# EAGLE design CPLD44 (EAGLE 6.6.0)
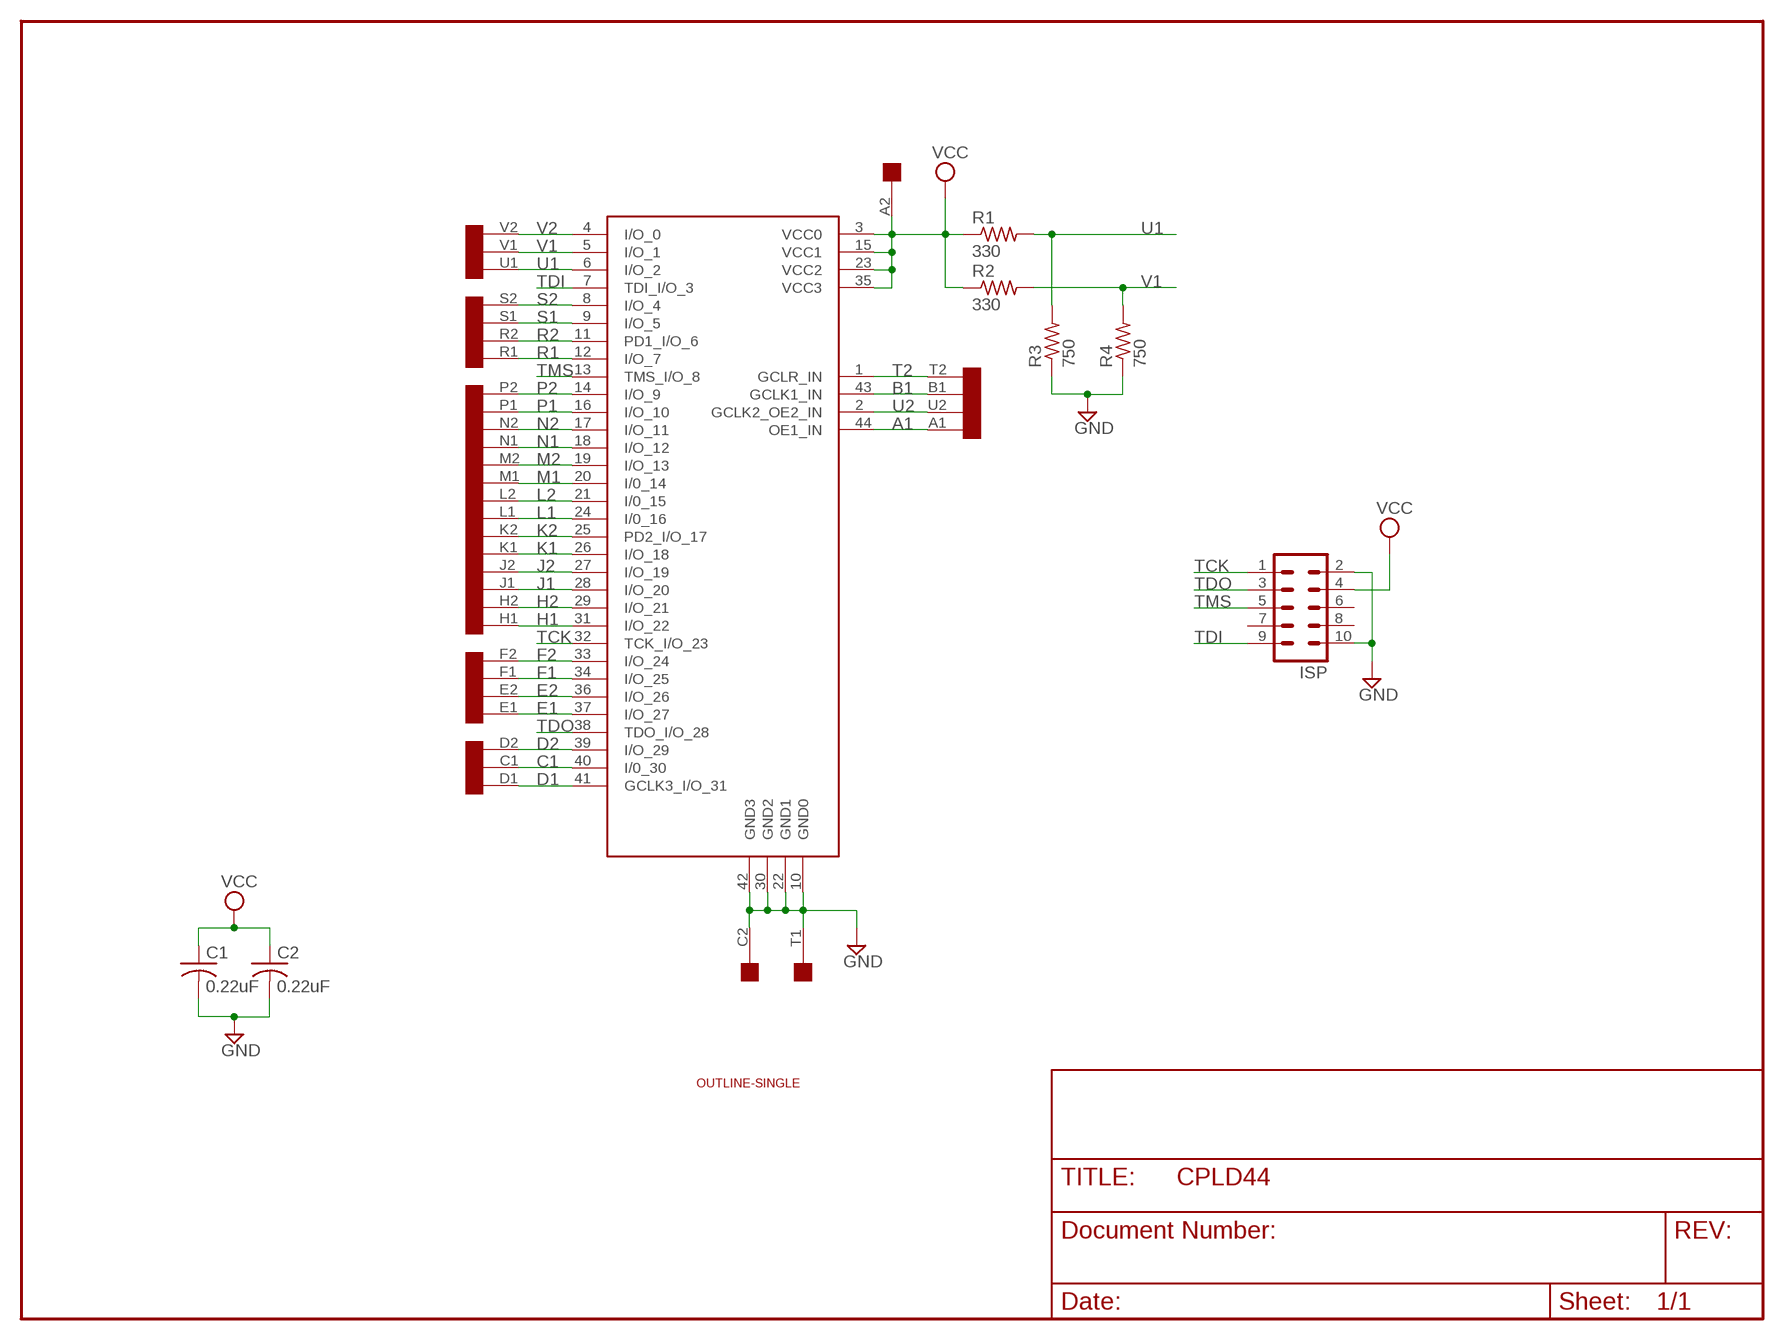
[diagram p0: schematic, sheet 1]

## Parts
C1  0.22uF  C-US050-025X075  [C050-025X075]
C2  0.22uF  C-US050-025X075  [C050-025X075]
E1  ATF1502PLCC44  [3M44]
ISP  MA05-2  [MA05-2]
R1  330  R-US_0207/10  [0207/10]
R2  330  R-US_0207/10  [0207/10]
R3  750  R-US_0207/10  [0207/10]
R4  750  R-US_0207/10  [0207/10]
U$1  SINGLE  [EDGE-CON2]
U$3  OUTLINE-SINGLE  [SINGLE]

## Nets
A1: E1.44(OE1_IN) U$1.A1
B1: E1.43(GCLK1_IN) U$1.B1
C1: E1.40(I/0_30) U$1.C1
D1: E1.41(GCLK3_I/O_31) U$1.D1
D2: E1.39(I/O_29) U$1.D2
E1: E1.37(I/O_27) U$1.E1
E2: E1.36(I/O_26) U$1.E2
F1: E1.34(I/O_25) U$1.F1
F2: E1.33(I/O_24) U$1.F2
GND: C1.2 C2.2 E1.10(GND0) E1.22(GND1) E1.30(GND2) E1.42(GND3) ISP.2 ISP.10 R3.1 R4.1 U$1.C2 U$1.T1
H1: E1.31(I/O_22) U$1.H1
H2: E1.29(I/O_21) U$1.H2
J1: E1.28(I/O_20) U$1.J1
J2: E1.27(I/O_19) U$1.J2
K1: E1.26(I/O_18) U$1.K1
K2: E1.25(PD2_I/O_17) U$1.K2
L1: E1.24(I/0_16) U$1.L1
L2: E1.21(I/0_15) U$1.L2
M1: E1.20(I/0_14) U$1.M1
M2: E1.19(I/O_13) U$1.M2
N1: E1.18(I/O_12) U$1.N1
N2: E1.17(I/O_11) U$1.N2
P1: E1.16(I/O_10) U$1.P1
P2: E1.14(I/O_9) U$1.P2
R1: E1.12(I/O_7) U$1.R1
R2: E1.11(PD1_I/O_6) U$1.R2
S1: E1.9(I/O_5) U$1.S1
S2: E1.8(I/O_4) U$1.S2
T2: E1.1(GCLR_IN) U$1.T2
TCK: E1.32(TCK_I/O_23) ISP.1
TDI: E1.7(TDI_I/O_3) ISP.9
TDO: E1.38(TDO_I/O_28) ISP.3
TMS: E1.13(TMS_I/O_8) ISP.5
U1: E1.6(I/O_2) R1.2 R3.2 U$1.U1
U2: E1.2(GCLK2_OE2_IN) U$1.U2
V1: E1.5(I/O_1) R2.2 R4.2 U$1.V1
V2: E1.4(I/O_0) U$1.V2
VCC: C1.1 C2.1 E1.3(VCC0) E1.15(VCC1) E1.23(VCC2) E1.35(VCC3) ISP.4 R1.1 R2.1 U$1.A2
Unconnected: ISP.6 ISP.7 ISP.8 U$1.B2

## Library data of the parts
C1 C2 = rcl:C-US: CAPACITOR, American symbol
E1 = atmel-cpld:ATF1502: ATD1502 CPLD
ISP = con-lstb:MA05-2: PIN HEADER
R1-R4 = rcl:R-US_: RESISTOR, American symbol
U$1 = dec-con:SINGLE: Single-Height DEC board
U$3 = dec-con:OUTLINE-*: Board outlines for DEC boards.

## Board
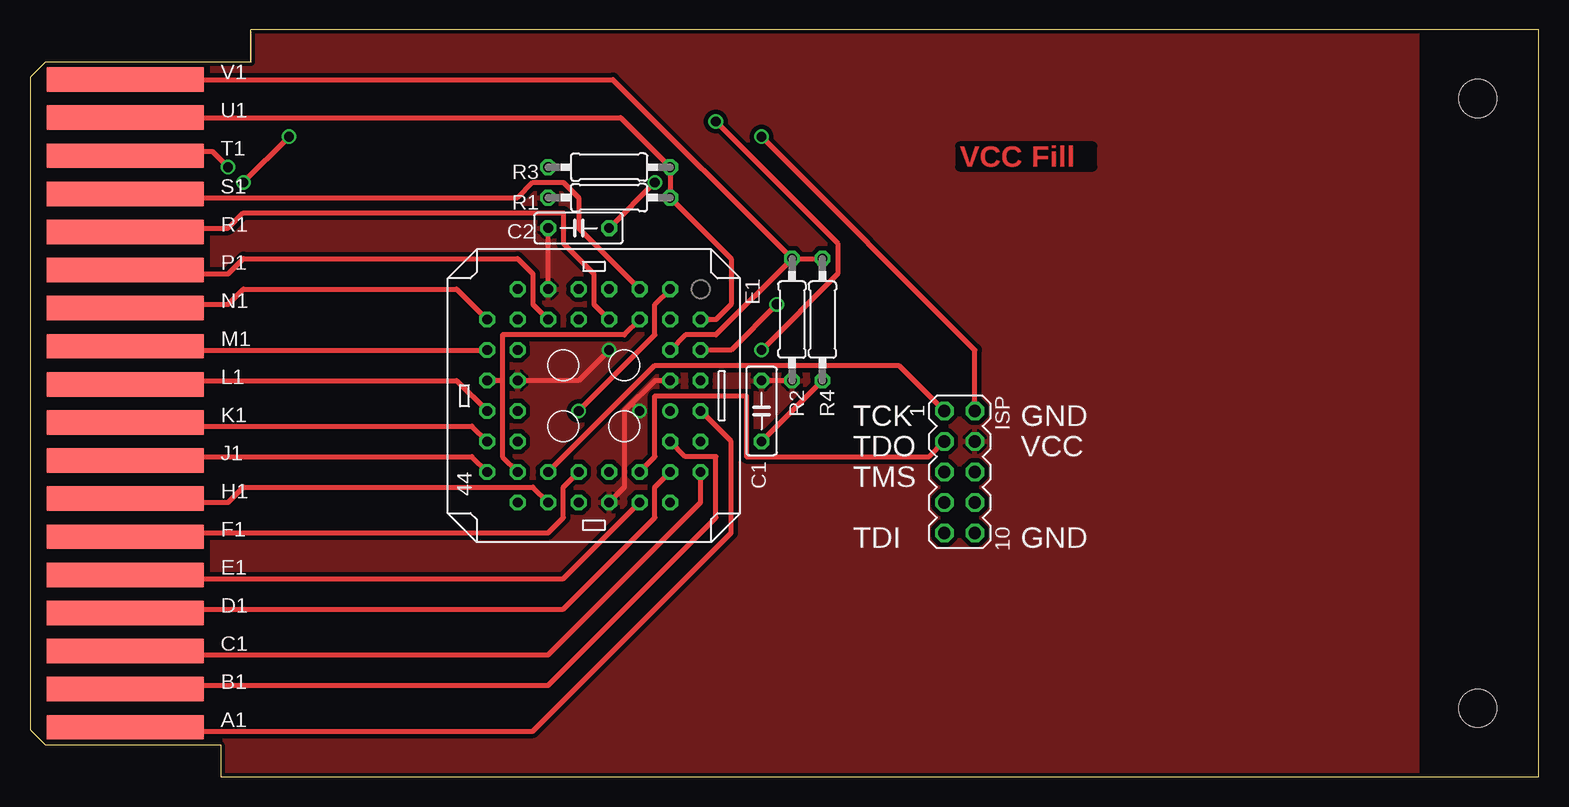
[diagram p1: board, top side]
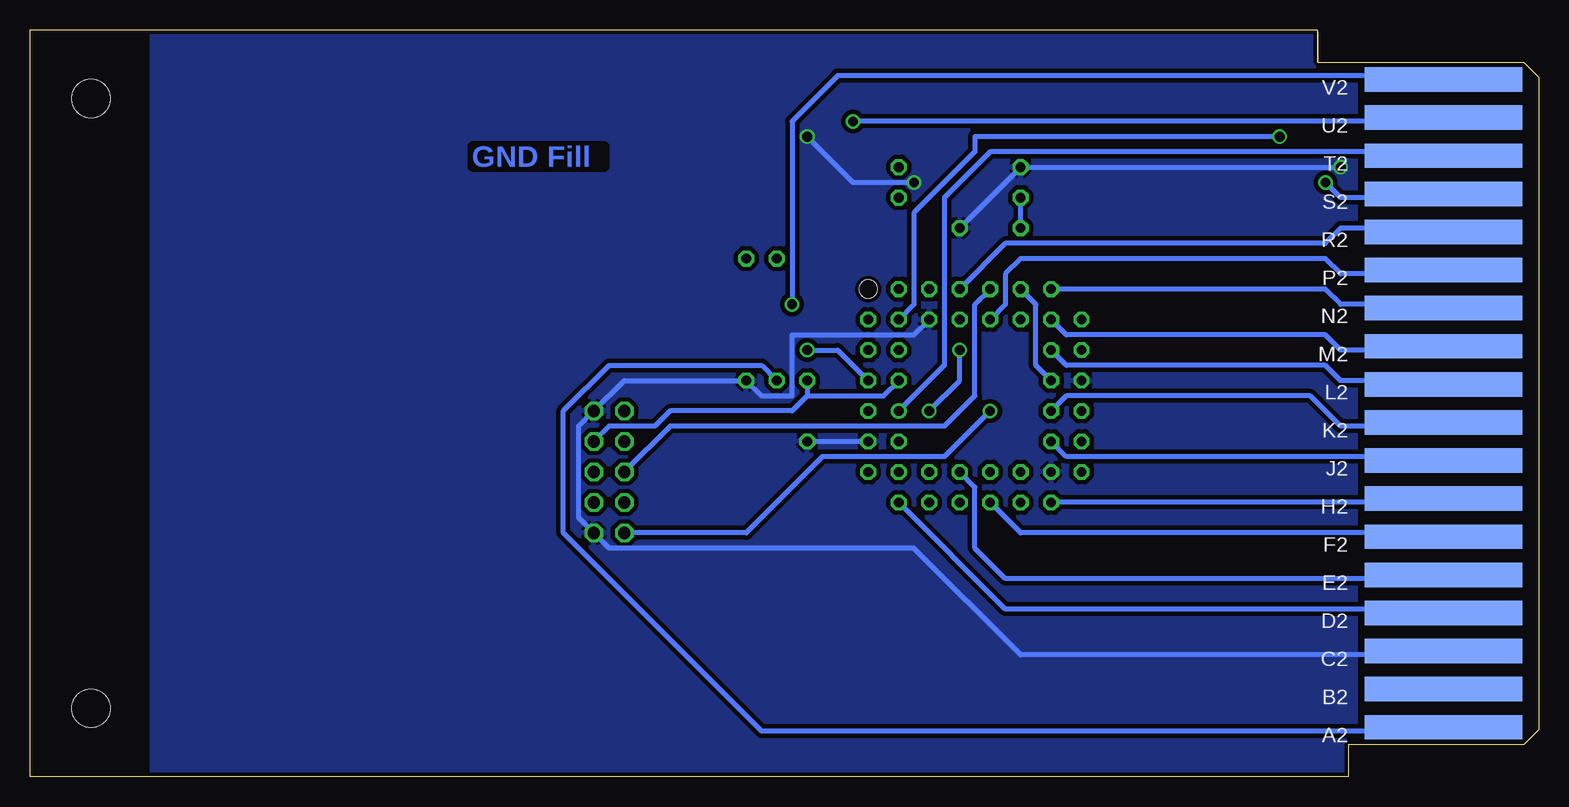
[diagram p2: board, bottom side, seen from below]

Size 125.73 x 62.23 mm. Coordinates in mm from the lower left corner, seen from the top.
Copper layers (1+16): Top 0.035mm / dielectric 1.5mm / Bottom 0.035mm
Design rules "16mils": minimum track width 16mil, minimum drill 32mil, track to track 15mil, track to pad 10mil, pad to pad 10mil, via to via 10mil, smd to smd 10mil, copper to edge 13mil, drill to drill 10mil, minimum pad ring 10mil, minimum via ring 8mil, stop-mask expansion 0mil, vias tented up to drill 0mil, thermal gap 10mil

### Footprints (pad centres in the part's own frame; a part is rotated, then mirrored left to right if it is on the bottom)
C050-025X075 = drill 0.813 octagon: 1 -2.54,0; 2 2.54,0
3M44 = drill 0.813: 1 1.27,6.35 | drill 0.813 octagon: 2 -1.27,8.89; 3 -1.27,6.35; 4 -3.81,8.89; 5 -3.81,6.35; 6 -6.35,8.89; 7 -8.89,6.35; 8 -6.35,6.35; 9 -8.89,3.81; 10 -6.35,3.81; 11 -8.89,1.27; 12 -6.35,1.27; 13 -8.89,-1.27; 14 -6.35,-1.27; 15 -8.89,-3.81; 16 -6.35,-3.81; 17 -8.89,-6.35; 18 -6.35,-8.89; 19 -6.35,-6.35; 20 -3.81,-8.89; 21 -3.81,-6.35; 22 -1.27,-8.89; 23 -1.27,-6.35; 24 1.27,-8.89; 25 1.27,-6.35; 26 3.81,-8.89; 27 3.81,-6.35; 28 6.35,-8.89; 29 8.89,-6.35; 30 6.35,-6.35; 31 8.89,-3.81; 32 6.35,-3.81; 33 8.89,-1.27; 34 6.35,-1.27; 35 8.89,1.27; 36 6.35,1.27; 37 8.89,3.81; 38 6.35,3.81; 39 8.89,6.35; 40 6.35,8.89; 41 6.35,6.35; 42 3.81,8.89; 43 3.81,6.35; 44 1.27,8.89 | hole 1.499: -8.89,8.89
MA05-2 = drill 1.016 octagon: 1 -5.08,-1.27; 2 -5.08,1.27; 3 -2.54,-1.27; 4 -2.54,1.27; 5 0,-1.27; 6 0,1.27; 7 2.54,-1.27; 8 2.54,1.27; 9 5.08,-1.27; 10 5.08,1.27
0207/10 = drill 0.813 octagon: 1 -5.08,0; 2 5.08,0
EDGE-CON2 = smd 13.106 x 2.032: A1 7.938,4.128; B1 7.938,7.303; C1 7.938,10.477; D1 7.938,13.652; E1 7.938,16.828; F1 7.938,20.003; H1 7.938,23.177; J1 7.938,26.352; K1 7.938,29.527; L1 7.938,32.703; M1 7.938,35.877; N1 7.938,39.053; P1 7.938,42.227; R1 7.938,45.403; S1 7.938,48.578; T1 7.938,51.752; U1 7.938,54.928; V1 7.938,58.102 | smd 13.106 x 2.032 bottom: A2 7.938,4.128; B2 7.938,7.303; C2 7.938,10.477; D2 7.938,13.652; E2 7.938,16.828; F2 7.938,20.003; H2 7.938,23.177; J2 7.938,26.352; K2 7.938,29.527; L2 7.938,32.703; M2 7.938,35.877; N2 7.938,39.053; P2 7.938,42.227; R2 7.938,45.403; S2 7.938,48.578; T2 7.938,51.752; U2 7.938,54.928; V2 7.938,58.102
SINGLE = hole 3.175: 120.65,56.515; 120.65,5.715

### Placement (x,y rotation side)
C1  60.96,30.48 270 top
C2  45.72,45.72 0 top
E1  46.99,31.75 270 top
ISP  77.47,25.4 270 top
R1  48.26,48.26 0 top
R2  63.5,38.1 90 top
R3  48.26,50.8 0 top
R4  66.04,38.1 90 top
U$1  0,0 0 top
U$3  0,0 0 top

### Tracks (layer width: path | path; a pad name or v marks a point on that pad's centre or on a via)
A1
  Top 0.406: U$1.A1 8.57,4.13 8.89,3.81 41.91,3.81 58.42,20.32 58.42,27.94 E1.44
B1
  Top 0.406: U$1.B1 8.57,7.3 8.89,7.62 43.18,7.62 57.15,21.59 57.15,26.67 54.61,26.67 E1.43
C1
  Top 0.406: U$1.C1 8.57,10.48 8.89,10.16 43.18,10.16 55.88,22.86 E1.40
D1
  Top 0.406: U$1.D1 8.57,13.65 8.89,13.97 44.45,13.97 52.07,21.59 52.07,24.13 E1.41
D2
  Bottom 0.406: U$1.D2 8.57,13.65 8.89,13.97 44.45,13.97 E1.39
E1
  Top 0.406: U$1.E1 8.57,16.83 8.89,16.51 44.45,16.51 E1.37
E2
  Bottom 0.406: U$1.E2 8.57,16.83 8.89,16.51 44.45,16.51 46.99,19.05 46.99,24.13 E1.36
F1
  Top 0.406: U$1.F1 8.57,20 8.89,20.32 43.18,20.32 44.45,21.59 44.45,24.13 E1.34
F2
  Bottom 0.406: U$1.F2 8.57,20 8.89,20.32 43.18,20.32 E1.33
GND  (via drill 0.81)
  Top 0.406: E1.30 39.37,26.67 39.37,33.02 | 39.37,33.02 E1.22 | E1.10 49.53,36.83 39.37,36.83 39.37,33.02 | v16.51,50.8 15.24,52.07 10.16,52.07 9.84,51.75 U$1.T1 | R4.1 C1.2 | ISP.2 78.74,35.56 v60.96,53.34 | v52.07,49.53 C2.2
  Bottom 0.406: C2.2 R3.1 v16.51,50.8 | C1.2 E1.42 | U$1.C2 13.97,10.16 43.18,10.16 52.07,19.05 77.47,19.05 ISP.10 80.01,21.59 80.01,29.21 ISP.2 76.2,33.02 R4.1 64.77,31.75 62.23,31.75 62.23,36.83 52.07,36.83 E1.10 | v60.96,53.34 57.15,49.53 v52.07,49.53
  pour Bottom: 15.24,0 15.24,60.96 15.24,62.23 115.57,62.23 115.57,0
H1
  Top 0.406: U$1.H1 8.57,23.18 8.89,22.86 16.51,22.86 17.78,24.13 41.91,24.13 E1.31
H2
  Bottom 0.406: U$1.H2 8.57,23.18 8.89,22.86 E1.29
J1
  Top 0.406: U$1.J1 8.57,26.35 8.89,26.67 36.83,26.67 E1.28
J2
  Bottom 0.406: U$1.J2 8.57,26.35 8.89,26.67 39.37,26.67 E1.27
K1
  Top 0.406: U$1.K1 8.57,29.53 8.89,29.21 36.83,29.21 E1.26
K2
  Bottom 0.406: U$1.K2 8.57,29.53 8.89,29.21 16.51,29.21 19.05,31.75 39.37,31.75 E1.25
L1
  Top 0.406: U$1.L1 8.57,32.7 8.89,33.02 35.56,33.02 E1.24
L2
  Bottom 0.406: U$1.L2 8.57,32.7 8.89,33.02 16.51,33.02 17.78,34.29 39.37,34.29 E1.21
M1
  Top 0.406: U$1.M1 8.57,35.88 8.89,35.56 E1.20
M2
  Bottom 0.406: U$1.M2 8.57,35.88 8.89,35.56 16.51,35.56 17.78,36.83 39.37,36.83 E1.19
N1
  Top 0.406: U$1.N1 8.57,39.05 8.89,39.37 16.51,39.37 17.78,40.64 35.56,40.64 E1.18
N2
  Bottom 0.406: U$1.N2 8.57,39.05 8.89,39.37 16.51,39.37 17.78,40.64 E1.17
P1
  Top 0.406: U$1.P1 8.57,42.23 8.89,41.91 16.51,41.91 17.78,43.18 40.64,43.18 41.91,41.91 41.91,39.37 E1.16
P2
  Bottom 0.406: U$1.P2 8.57,42.23 8.89,41.91 16.51,41.91 17.78,43.18 43.18,43.18 44.45,41.91 44.45,39.37 E1.14
R1
  Top 0.406: U$1.R1 8.57,45.4 8.89,45.72 16.51,45.72 17.78,46.99 44.45,46.99 44.45,44.45 46.99,41.91 46.99,39.37 E1.12
R2
  Bottom 0.406: U$1.R2 8.57,45.4 8.89,45.72 16.51,45.72 17.78,44.45 44.45,44.45 E1.11
S1
  Top 0.406: U$1.S1 8.57,48.58 8.89,48.26 40.64,48.26 41.91,49.53 44.45,49.53 45.72,48.26 45.72,45.72 E1.9
S2  (via drill 0.81)
  Top 0.406: v17.78,49.53 v21.59,53.34
  Bottom 0.406: U$1.S2 8.57,48.58 8.89,48.26 16.51,48.26 v17.78,49.53 | E1.8 52.07,39.37 52.07,46.99 46.99,52.07 46.99,53.34 v21.59,53.34
T2
  Bottom 0.406: U$1.T2 8.26,52.07 45.72,52.07 49.53,48.26 49.53,34.29 E1.1
TCK
  Top 0.406: E1.32 52.07,34.29 72.39,34.29 ISP.1
TDI  (via drill 0.81)
  Top 0.406: E1.7 52.07,39.37 52.07,36.83 v45.72,30.48
  Bottom 0.406: v45.72,30.48 49.53,26.67 59.69,26.67 66.04,20.32 ISP.9
TDO
  Top 0.406: E1.38 52.07,26.67 52.07,31.75 59.69,31.75 59.69,26.67 74.93,26.67 ISP.3
TMS
  Bottom 0.406: E1.13 46.99,39.37 46.99,31.75 49.53,29.21 72.39,29.21 ISP.5
U1
  Top 0.406: U$1.U1 49.21,54.93 R3.2 R1.2 58.42,43.18 58.42,39.37 57.15,38.1 E1.6
U2  (via drill 0.81)
  Top 0.406: v60.96,35.56 67.31,41.91 67.31,44.45 v57.15,54.61
  Bottom 0.406: E1.2 58.42,35.56 v60.96,35.56 | v57.15,54.61 13.97,54.61 U$1.U2
V1
  Top 0.406: U$1.V1 48.58,58.1 R2.2 | R2.2 R4.2 | E1.5 54.61,36.83 57.15,36.83 R2.2
V2  (via drill 0.81)
  Top 0.406: E1.4 58.42,35.56 v62.23,39.37
  Bottom 0.406: v62.23,39.37 62.23,54.61 58.42,58.42 13.97,58.42 U$1.V2
VCC  (via drill 0.81)
  Top 0.406: E1.15 C2.1 | R2.1 C1.1 | E1.35 49.53,24.13 49.53,30.48 | 49.53,30.48 52.07,33.02 E1.3 | E1.23 45.72,33.02 v48.26,35.56 | 49.53,30.48 50.17,31.11 v50.8,30.48
  Bottom 0.406: E1.23 41.91,34.29 41.91,39.37 E1.15 | C1.1 60.96,31.75 | 60.96,31.75 54.61,31.75 E1.3 | v48.26,35.56 48.26,33.02 v50.8,30.48 | C2.1 R1.1 | ISP.4 77.47,29.21 73.66,29.21 72.39,30.48 62.23,30.48 60.96,31.75 | R2.1 64.77,34.29 77.47,34.29 81.28,30.48 81.28,20.32 64.77,3.81 13.97,3.81 U$1.A2
  pour Top: 15.24,0 15.24,62.23 115.57,62.23 115.57,0

### Text on the board
Top: VCC Fill
Bottom: GND Fill
tPlace: TCK | GND | TDO | VCC | TMS | TDI | GND